# Altium project mat'_v4.PrjPcb (part 2 of 2)

## Sheet DCDC_Jetson.SchDoc: Материнская плата аппарата NeoWelt v.2
size 420 x 297 mm; Address1: Address1; Address2: Address2; Address3: Address3; Address4: Address4; DocumentNumber: 4; SheetNumber: 2; SheetTotal: 4
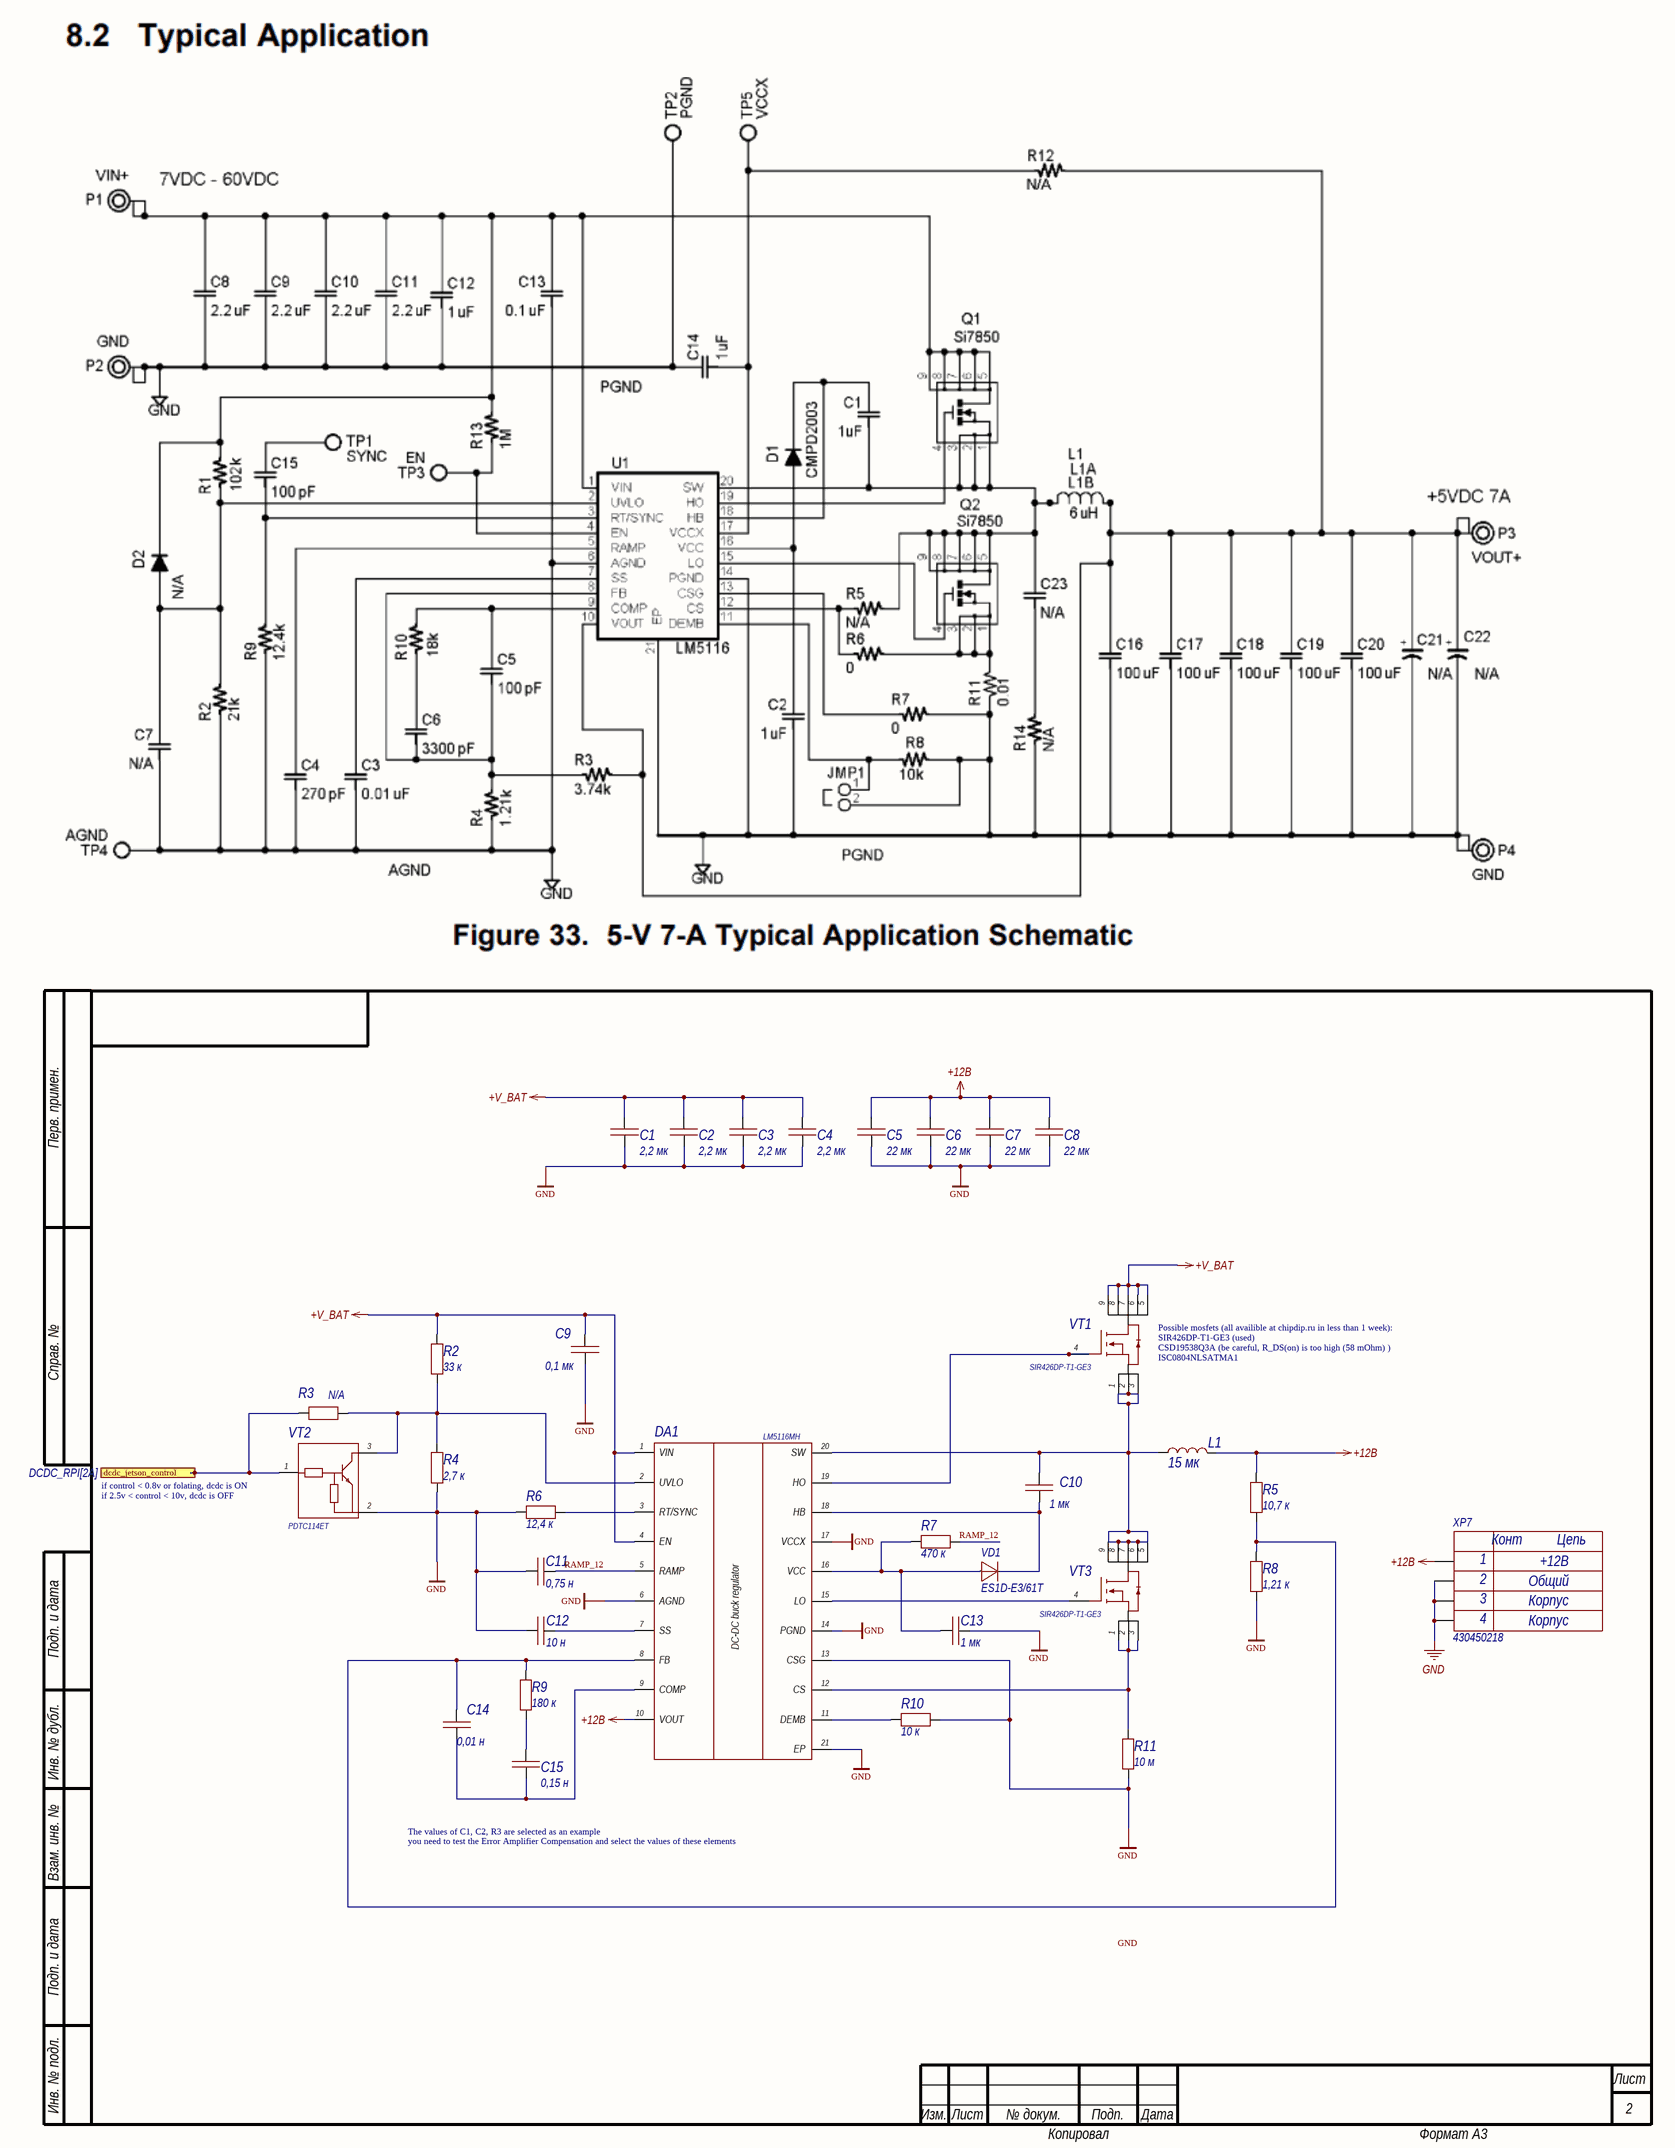
[diagram p11: DCDC_Jetson.SchDoc]

### Parts
(Parts that share a designator on the sheet are numbered #1, #2 ... from top to bottom, then left to right.)
C1#2  value 2,2 мк  [1206C]  (hidden comment: Capacitor)
C2#2  value 2,2 мк  [1206C]  (hidden comment: Capacitor)
C3#2  value 2,2 мк  [1206C]  (hidden comment: Capacitor)
C4#2  value 2,2 мк  [1206C]  (hidden comment: Capacitor)
C5#2  value 22 мк  [1210C]  (hidden comment: Capacitor)
C6#2  value 22 мк  [1210C]  (hidden comment: Capacitor)
C7#2  value 22 мк  [1210C]  (hidden comment: Capacitor)
C8#2  value 22 мк  [1210C]  (hidden comment: Capacitor)
C9  value 0,1 мк  [0603C]  (hidden comment: Capacitor)
C10  value 1 мк  [0603C]  (hidden comment: Capacitor)
C11  value 0,75 н  [0603C]  (hidden comment: Capacitor)
C12  value 10 н  [0603C]  (hidden comment: Capacitor)
C13  value 1 мк  [0603C]  (hidden comment: Capacitor)
C14  value 0,01 н  [0603C]  (hidden comment: Capacitor)
C15  value 0,15 н  [0603C]  (hidden comment: Capacitor)
DA1  LM5116MH  [HTSSOP-20]
L1#2  value 15 мк  [SPRH127]  (hidden comment: CDSPRH127-150M)
R2#2  value 33 к  [0603R]  (hidden comment: Resistor)
R3#2  Resistor  [0603R]  (value not drawn)
R4#2  value 2,7 к  [0603R]  (hidden comment: Resistor)
R5#2  value 10,7 к  [0603R]  (hidden comment: Resistor)
R6#2  value 12,4 к  [0603R]  (hidden comment: Resistor)
R7#2  value 470 к  [0603R]  (hidden comment: Resistor)
R8#2  value 1,21 к  [0603R]  (hidden comment: Resistor)
R9#2  value 180 к  [0603R]  (hidden comment: Resistor)
R10#2  value 10 к  [0603R]  (hidden comment: Resistor)
R11#2  value 10 м  [1210R]  (hidden comment: Resistor)
VD1  ES1D-E3/61T  [SMA]
VT1  SIR426DP-T1-GE3  [PowerPAK_SO-8]
VT2  PDTC114ET  [SOT23-3]
VT3  SIR426DP-T1-GE3  [PowerPAK_SO-8]
XP7  430450218  Value3: Корпус  Value2: Общий  Value1: +12В  [Molex_430450218]

### Ports
dcdc_jetson_control (in, see DCDC_RPI[2A])

### Nets
+12В: C5#2.2 C6#2.2 C7#2.2 C8#2.2 DA1.10(VOUT) L1#2.2 R5#2.2 XP7.1
+V_BAT: C1#2.2 C2#2.2 C3#2.2 C4#2.2 C9.2 DA1.1(VIN) DA1.4(EN) R2#2.2 VT1.5 VT1.6 VT1.7 VT1.8 VT1.9
GND: C1#2.1 C2#2.1 C3#2.1 C4#2.1 C5#2.1 C6#2.1 C7#2.1 C8#2.1 C9.1 C11.1 C12.1 C13.2 DA1.6(AGND) DA1.13(CSG) DA1.14(PGND) DA1.17(VCCX) DA1.21(EP) R4#2.1 R6#2.1 R8#2.1 R10#2.2 R11#2.1 VT2.2(E) XP7.0 XP7.2
RAMP_12: C11.2 DA1.5(RAMP) R7#2.2
NetC10_1: C10.1 DA1.18(HB) VD1.2
NetC10_2: C10.2 DA1.20(SW) L1#2.1 VT1.1 VT1.2 VT1.3 VT3.5 VT3.6 VT3.7 VT3.8 VT3.9
NetC12_2: C12.2 DA1.7(SS)
NetC13_1: C13.1 DA1.16(VCC) R7#2.1 VD1.1
NetC14_1: C14.1 C15.1 DA1.9(COMP)
NetC14_2: C14.2 DA1.8(FB) R5#2.1 R8#2.2 R9#2.2
NetC15_2: C15.2 R9#2.1
NetDA1_2: DA1.2(UVLO) R2#2.1 R3#2.2 R4#2.2 VT2.3(C)
NetDA1_3: DA1.3(RT/SYNC) R6#2.2
NetDA1_11: DA1.11(DEMB) R10#2.1
NetDA1_12: DA1.12(CS) R11#2.2 VT3.1 VT3.2 VT3.3
NetDA1_15: DA1.15(LO) VT3.4
NetDA1_19: DA1.19(HO) VT1.4
NetR3#2_1: R3#2.1 VT2.1(B) ; port dcdc_jetson_control

### Notes on the sheet
- (near VT1) Possible mosfets (all availible at chipdip.ru in less than 1 week):
- (near VT1) CSD19538Q3A (be careful, R_DS(on) is too high (58 mOhm) )
- (near VT1) SIR426DP-T1-GE3 (used)
- (near VT1) ISC0804NLSATMA1
- (near VT2) if 2.5v < control < 10v, dcdc is OFF
- (near VT2) if control < 0.8v or folating, dcdc is ON
- The values of C1, C2, R3 are selected as an example
- you need to test the Error Amplifier Compensation and select the values of these elements
- Labels drawn without touching a wire or pin: GND
- Перв. примен.
- Справ. №
- Подп. и дата
- Инв. № дубл.
- Взам. инв. №
- Инв. № подл.
- Изм.
- Лист
- № докум.
- Подп.
- Дата
- Копировал
- Формат А3
- (in symbol LM5116MH) DC-DC buck regulator
- (in symbol Molex_430450218) Конт; Цепь; 3; 4

### Library data of the parts
C1#2 C2#2 C3#2 C4#2 = Capacitor_2,2u_10_50V_X7R_1206C: Конденсатор; Library Path2: Schematic\Capacitor.SchLib; Tolerance: 0,1; Voltage (V): 50; Dielectric: X7R; Capacity (nF): 2200; Part Number: Capacitor_2,2u_10_50V_X7R_1206C
C5#2 C6#2 C7#2 C8#2 = Capacitor_22u_10_25V_X7R_1210C: Конденсатор; Library Path2: Schematic\Capacitor.SchLib; Tolerance: 0,1; Voltage (V): 25; Dielectric: X7R; Capacity (nF): 22000; Part Number: Capacitor_22u_10_25V_X7R_1210C
C9 = Capacitor_0,1u_10_50V_X7R_0603C: Конденсатор; Library Path2: Schematic\Capacitor.SchLib; Tolerance: 0,1; Voltage (V): 50; Dielectric: X7R; Capacity (nF): 100; Part Number: Capacitor_0,1u_10_50V_X7R_0603C
C10 C13 = Capacitor_1u_10_50V_X7R_0603C: Конденсатор; Library Path2: Schematic\Capacitor.SchLib; Tolerance: 0,1; Voltage (V): 50; Dielectric: X7R; Capacity (nF): 1000; Part Number: Capacitor_1u_10_50V_X7R_0603C
C11 = Capacitor_0,75n_10_50V_X7R_0603C: Конденсатор; Library Path2: Schematic\Capacitor.SchLib; Tolerance: 0,1; Voltage (V): 50; Dielectric: X7R; Capacity (nF): 0,75; Part Number: Capacitor_0,75n_10_50V_X7R_0603C
C12 = Capacitor_10n_10_50V_X7R_0603C: Конденсатор; Library Path2: Schematic\Capacitor.SchLib; Tolerance: 0,1; Voltage (V): 50; Dielectric: X7R; Capacity (nF): 10; Part Number: Capacitor_10n_10_50V_X7R_0603C
C14 = Capacitor_0,01n_10_50V_X7R_0603C: Конденсатор; Library Path2: Schematic\Capacitor.SchLib; Tolerance: 0,1; Voltage (V): 50; Dielectric: X7R; Capacity (nF): 0,01; Part Number: Capacitor_0,01n_10_50V_X7R_0603C
C15 = Capacitor_0,15n_10_50V_X7R_0603C: Конденсатор; Library Path2: Schematic\Capacitor.SchLib; Tolerance: 0,1; Voltage (V): 50; Dielectric: X7R; Capacity (nF): 0,15; Part Number: Capacitor_0,15n_10_50V_X7R_0603C
DA1 = LM5116MH: dc-dc понижающий adj 6-100v; Manufacturer_Part_Number: LM5116MH/NOPB; Part Number: LM5116MH
L1#2 = CDSPRH127-150M: Индуктивность на 15 мкГн, номинальный ток 8,4 А; Inductance (μH): 15; Current (A): 8,4; Part Number: CDSPRH127-150M
R2#2 = Resistor_33k_1_0603: Резистор номиналом 33 кОм и точностью 1%; Power: *; Part Number: Resistor_33k_1_0603; Tolerance: 1%
R3#2 = res_0603_N/A: посадочное место 0603 под перемычку; Tolerance: 1%; Power: *; Value: N/A; Part Number: res_0603_N/A
R4#2 = Resistor_2.7k_1_0603: Резистор номиналом 2,7 кОм и точностью 1%; Power: *; Part Number: Resistor_2.7k_1_0603; Tolerance: 1%
R5#2 = Resistor_10.7k_1_0603: Резистор номиналом 10,7 кОм и точностью 1%; Power: *; Part Number: Resistor_10.7k_1_0603; Tolerance: 1%
R6#2 = Resistor_12.4k_1_0603: Резистор номиналом 12,4 кОм и точностью 1%; Power: *; Part Number: Resistor_12.4k_1_0603; Tolerance: 1%
R7#2 = Resistor_470k_1_0603: Резистор номиналом 470 кОм и точностью 1%; Power: *; Part Number: Resistor_470k_1_0603; Tolerance: 1%
R8#2 = Resistor_1.21k_1_0603: Резистор номиналом 1,21 кОм и точностью 1%; Power: *; Part Number: Resistor_1.21k_1_0603; Tolerance: 1%
R9#2 = Resistor_180k_1_0603: Резистор номиналом 180 кОм и точностью 1%; Power: *; Part Number: Resistor_180k_1_0603; Tolerance: 1%
R10#2 = Resistor_10k_1_0603: Резистор номиналом 10 кОм и точностью 1%; Power: *; Part Number: Resistor_10k_1_0603; Tolerance: 1%
R11#2 = RL1210FR-070R01L: Резистор номиналом 10 мОм, точностью 1%, 0.5Вт; Power: *; Part Number: RL1210FR-070R01L; Tolerance: 1%
VD1 = ES1D-E3/61T: Диод 1A 200V; Repetitive peak reverse voltage (Vrrm): 200; Current (A): 1; Part Number: ES1D-E3/61T
VT1 VT3 = SIR426DP-T1-GE3: Транзистор полевой MOSFET N-канальный 40В 41.7Вт; Part Number: SIR426DP-T1-GE3; Напряжение С-И/К-Э: 40 В
VT2 = PDTC114ET: цифровой npn 50в 100мА; Ток макс#: 0, 1 А; Part Number: PDTC114ET; Напряжение С-И/К-Э: 50 В
XP7 = Molex_430450218: Разъем типа провод-плата, 3 мм, 2 контакт(-ов), Штыревой Разъем, Серия Micro-Fit для поверхностного монтажа; System: Connector; Value4: Корпус; Part Number: Molex_430450218

## Nets that join several sheets
+1.1: 1gb_switch (23 pins), dc-dc_eth+pump (6 pins)
+3.3_switch: 1gb_switch (24 pins), dc-dc_eth+pump (6 pins)
+5В: cm5 (15 pins), DCDC_RPI (7 pins), connectors (5 pins)
+V_BAT: DCDC_RPI (13 pins), dc-dc_eth+pump (9 pins), connectors (XP2.29 XP2.33), DCDC_Jetson (13 pins)
GND: cm5 (94 pins), DCDC_RPI (23 pins), 1gb_switch (62 pins), dc-dc_eth+pump (19 pins), connectors (16 pins), DCDC_Jetson (25 pins)
DCDC_EN: dc-dc_eth+pump (VT4#2.1), connectors (XP1.A15)
ETH_RP0_N: cm5 (DD1.10), 1gb_switch (C61.2)
ETH_RP0_P: cm5 (DD1.12), 1gb_switch (C60.2)
ETH_RP1_N: cm5 (DD1.6), 1gb_switch (C63.2)
ETH_RP1_P: cm5 (DD1.4), 1gb_switch (C62.2)
ETH_RP2_N: cm5 (DD1.9), 1gb_switch (C65.2)
ETH_RP2_P: cm5 (DD1.11), 1gb_switch (C64.2)
ETH_RP3_N: cm5 (DD1.5), 1gb_switch (C67.2)
ETH_RP3_P: cm5 (DD1.3), 1gb_switch (C66.2)
NetR3#2_1: DCDC_RPI (R13.1 VT5.1), DCDC_Jetson (R3#2.1 VT2.1)
RS485_N: cm5 (DD3.7 R9#1.2), connectors (XP1.B16)
RS485_P: cm5 (DD3.6 R9#1.1), connectors (XP1.B15)

## Assembly variants
01: not fitted SB1 SB2 SB3